# EAGLE design HPR_wo_comm (EAGLE 9.6.2)
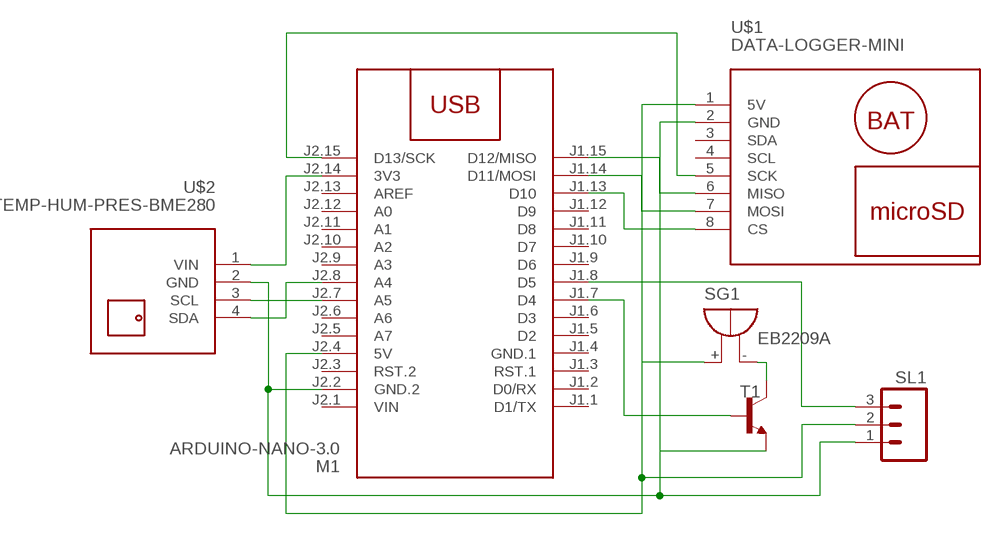
[diagram p0: schematic, sheet 1]

## Parts
M1  ARDUINO-NANO-3.0  [ARDUINO-NANO-3.0]
SG1  EB2209A  [EB2209A]
SL1  M03  [03P]
T1  2N3700-NPN-TO18-EBC  [TO18]
U$1  DATA-LOGGER-MINI  [DATA-LOGGER-MINI]
U$2  TEMP-HUM-PRES-BME280  [TEMP-HUM-PRES-BME280]

## Nets
N$1: M1.J2.14(3V3) U$2.1(VIN)
N$2: M1.J1.7(D4) T1.2(B)
N$3: M1.J2.7(A5) U$2.3(SCL)
N$4: M1.J2.8(A4) U$2.4(SDA)
N$5: M1.J1.15(D12/MISO) U$1.6(MISO)
N$6: M1.J1.14(D11/MOSI) U$1.7(MOSI)
N$7: M1.J1.13(D10) U$1.8(CS)
N$8: M1.J2.15(D13/SCK) U$1.5(SCK)
N$9: M1.J2.4(5V) SG1.+ SL1.2 U$1.1(5V)
N$10: M1.J2.2(GND.2) SL1.1 T1.1(E) U$1.2(GND) U$2.2(GND)
N$11: SG1.- T1.3(C)
N$12: M1.J1.8(D5) SL1.3
Unconnected: M1.J1.1(D1/TX) M1.J1.2(D0/RX) M1.J1.3(RST.1) M1.J1.5(D2) M1.J1.6(D3) M1.J1.9(D6) M1.J1.10(D7) M1.J1.11(D8) M1.J1.12(D9) M1.J2.3(RST.2) M1.J2.5(A7) M1.J2.6(A6) M1.J2.9(A3) M1.J2.10(A2) M1.J2.11(A1) M1.J2.12(A0) M1.J2.13(AREF) U$1.3(SDA) U$1.4(SCL)

## Power pins joined to a net without a drawn wire
GND.1: M1.J1.4(GND.1)
VIN: M1.J2.1(VIN)

## Library data of the parts
M1 = diy-modules:ARDUINO-NANO-3.0: Arduino Nano 3.0 and compatible devices More details available here: https://www.arduino.cc/en/Main/ArduinoBoardNano Click here to find device on ebay.com <http://www.ebay.com/sch/arduino+nano>
SG1 = buzzer:EB2209A: BUZZER Source: Buerklin; OC_FARNELL: unknown; OC_NEWARK: unknown
SL1 = con-amp-quick:M03: AMP QUICK CONNECTOR; OC_FARNELL: unknown; OC_NEWARK: unknown
T1 = transistor:*-NPN-: NPN Transistror BF959 corrected 2008.03.06
U$1 = HC SR04:DATA-LOGGER-MINI: Mini Data Logger with microSD card and battery powered RTC based on DS1307 chip Arduino library for DS1307 and description are available here: https://www.pjrc.com/teensy/td_libs_DS1307RTC.html Tutorial how to use SD card with Arduino: https://www.arduino.cc/en/reference/SD Click here to find device on ebay.com <http://www.ebay.com/sch/mini+data+logger+arduino>
U$2 = diy-modules:TEMP-HUM-PRES-BME280: Digital Humidity-Temperature-Pressure Sensor based on BME280 device More information about BME280 device is available here: https://www.bosch-sensortec.com/bst/products/all_products/bme280 Click here to find device on ebay.com <http://www.ebay.com/sch/bme280+breakout>

## Board
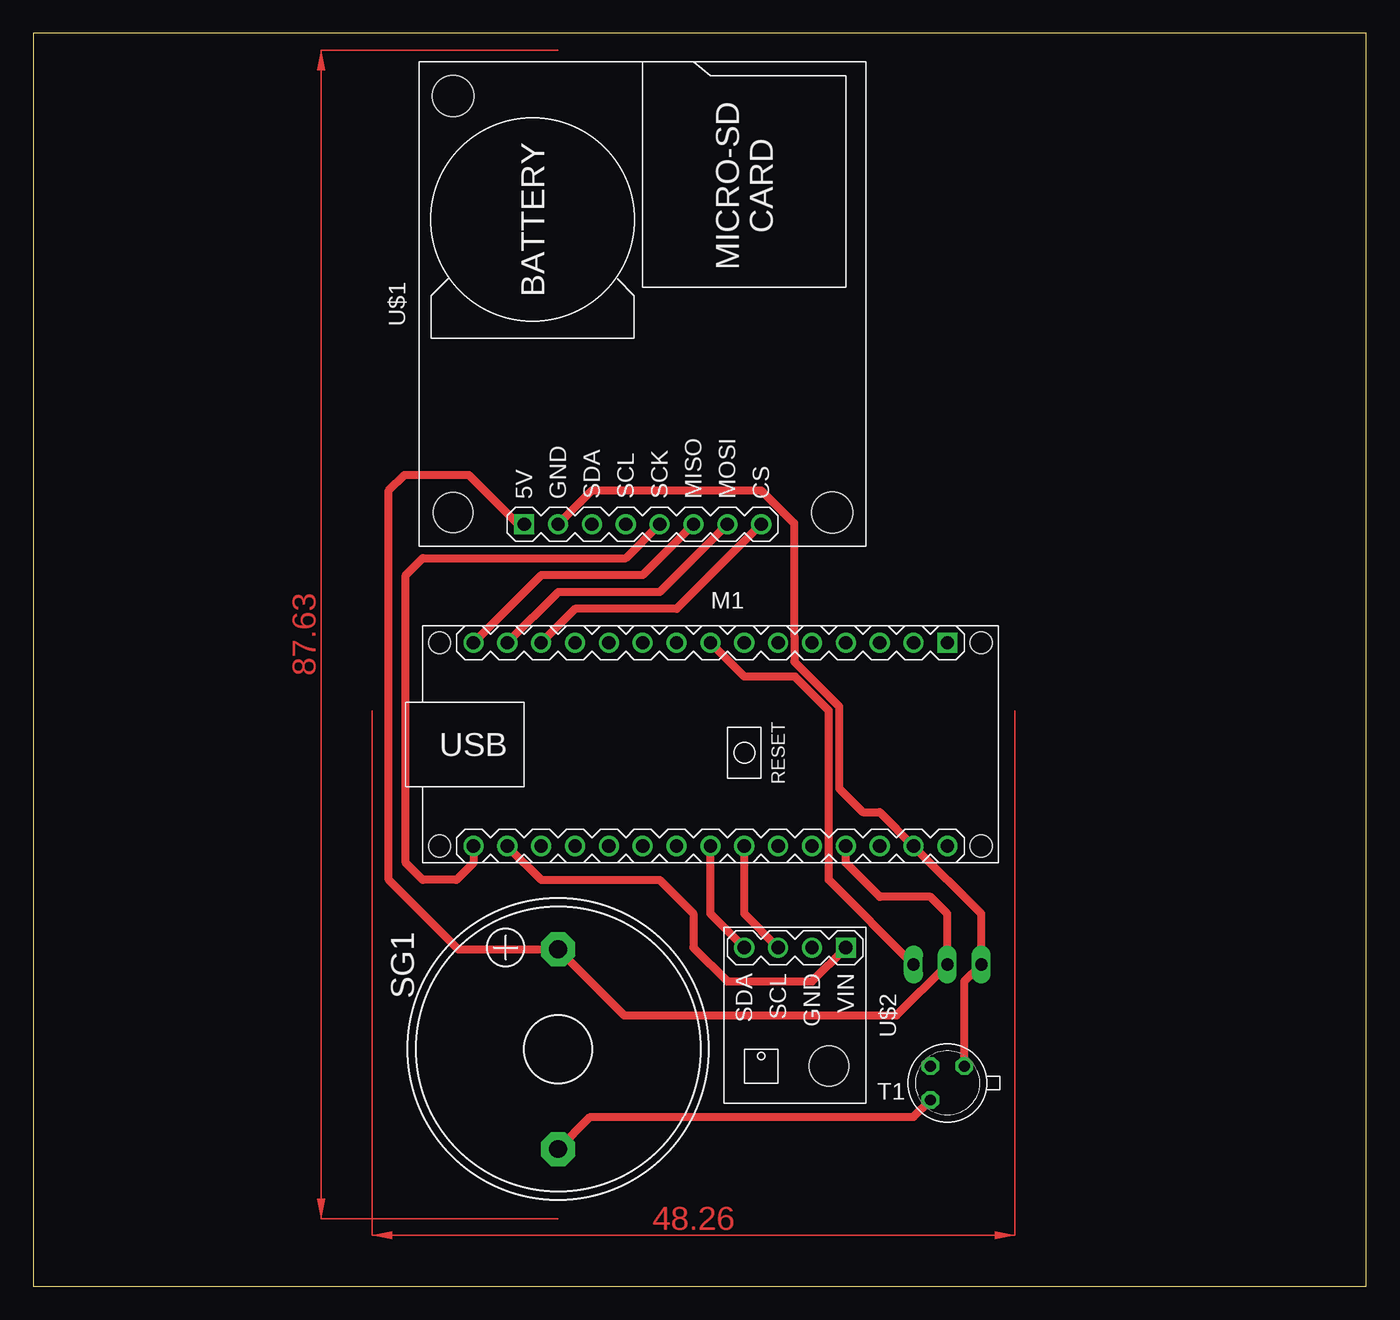
[diagram p1: board, top side]
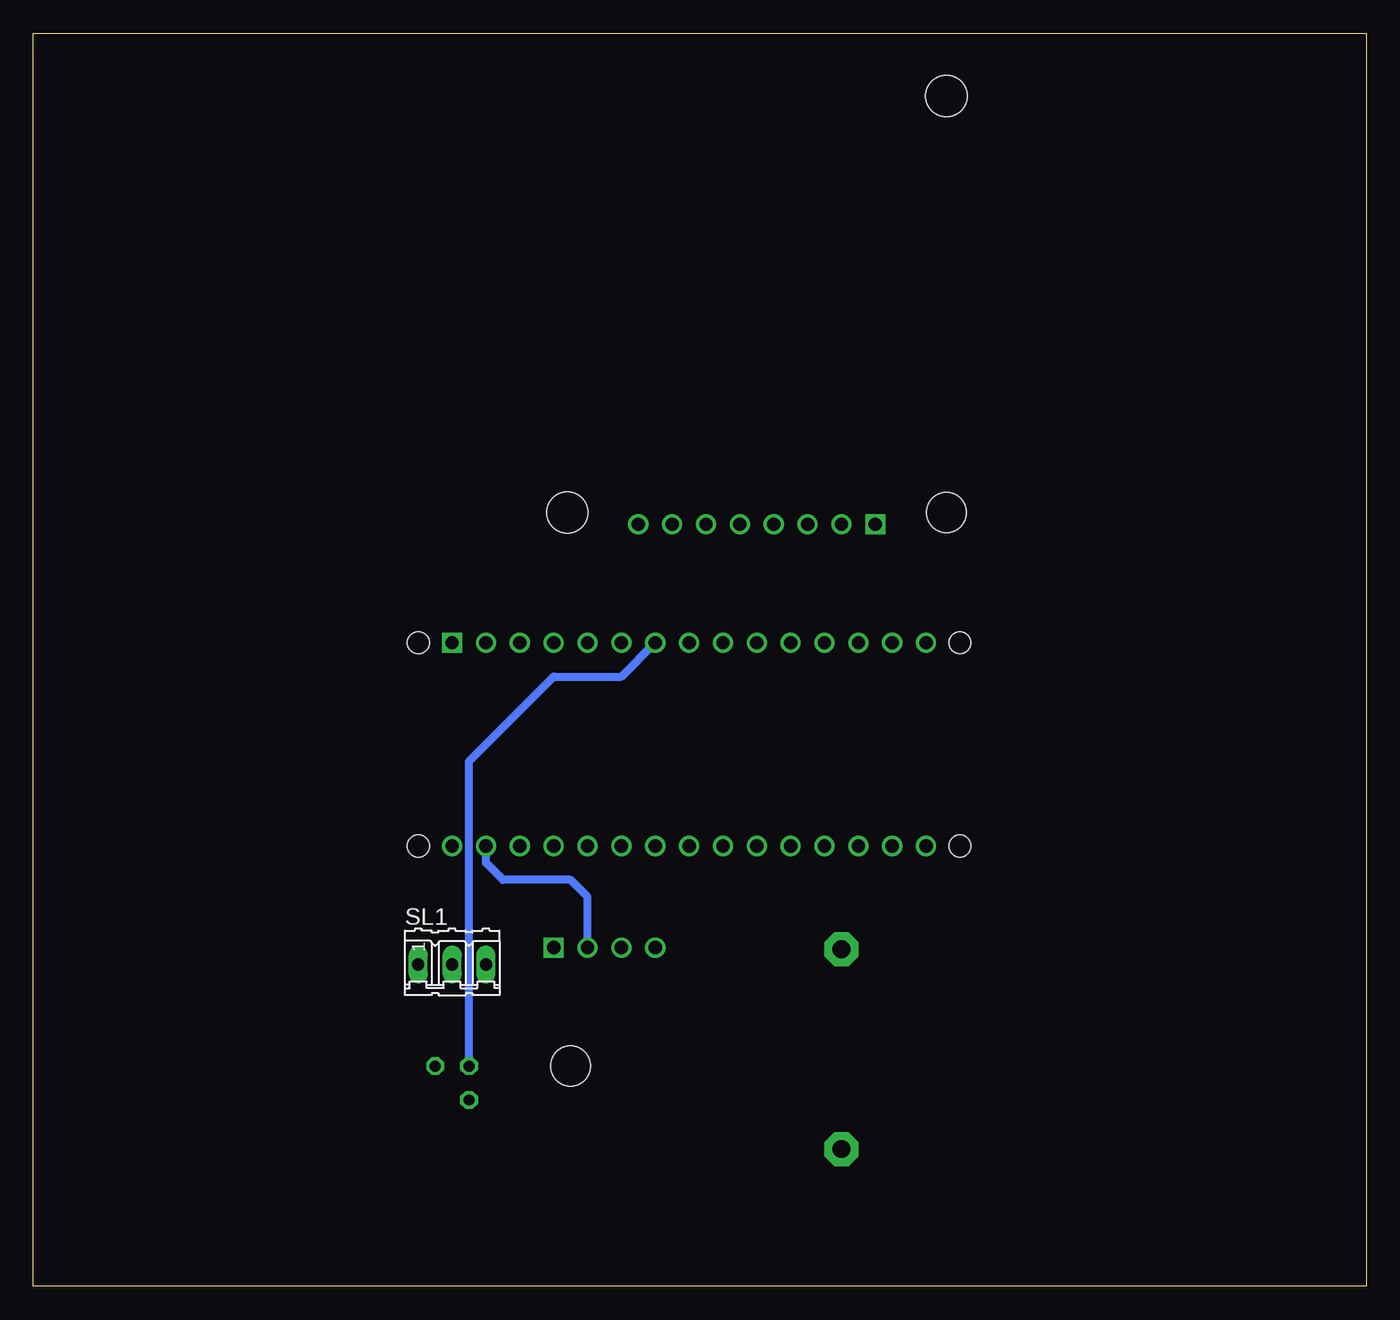
[diagram p2: board, bottom side, seen from below]

Size 100 x 93.97 mm. Coordinates in mm from the lower left corner, seen from the top.
Outline: 0,0 100,0 100,93.97 0,93.97 0,0
Copper layers (1*16): Top 0.035mm / dielectric 1.5mm / Bottom 0.035mm
Design rules "default": minimum track width 6mil, minimum drill 0.35mm, track to track 6mil, track to pad 6mil, pad to pad 6mil, via to via 6mil, smd to smd 6mil, copper to edge 40mil, drill to drill 6mil, minimum pad ring 10mil, minimum via ring 8mil, stop-mask expansion 4mil, vias tented up to drill 0mil, thermal gap 10mil

### Footprints (pad centres in the part's own frame; a part is rotated, then mirrored left to right if it is on the bottom)
ARDUINO-NANO-3.0 = drill 1 square: J1.1 17.78,7.62 | drill 1: J1.2 15.24,7.62; J1.3 12.7,7.62; J1.4 10.16,7.62; J1.5 7.62,7.62; J1.6 5.08,7.62; J1.7 2.54,7.62; J1.8 0,7.62; J1.9 -2.54,7.62; J1.10 -5.08,7.62; J1.11 -7.62,7.62; J1.12 -10.16,7.62; J1.13 -12.7,7.62; J1.14 -15.24,7.62; J1.15 -17.78,7.62; J2.1 17.78,-7.62; J2.2 15.24,-7.62; J2.3 12.7,-7.62; J2.4 10.16,-7.62; J2.5 7.62,-7.62; J2.6 5.08,-7.62; J2.7 2.54,-7.62; J2.8 0,-7.62; J2.9 -2.54,-7.62; J2.10 -5.08,-7.62; J2.11 -7.62,-7.62; J2.12 -10.16,-7.62; J2.13 -12.7,-7.62; J2.14 -15.24,-7.62; J2.15 -17.78,-7.62 | hole 1.651: -20.32,7.62; -20.32,-7.62; 20.32,-7.62; 20.32,7.62
EB2209A = drill 1.321 pad 2.54 octagon: + 7.493,0; - -7.493,0
03P = drill 0.914 long: 1 -2.54,0; 2 0,0; 3 2.54,0
TO18 = drill 0.813 octagon: 1 -1.27,-1.27; 2 1.27,-1.27; 3 1.27,1.27
DATA-LOGGER-MINI = drill 1 square: 1 -16.51,8.89 | drill 1: 2 -16.51,6.35; 3 -16.51,3.81; 4 -16.51,1.27; 5 -16.51,-1.27; 6 -16.51,-3.81; 7 -16.51,-6.35; 8 -16.51,-8.89 | hole 3: -15.621,14.224 | hole 3.1: -15.621,-14.224; 15.621,14.224
TEMP-HUM-PRES-BME280 = drill 1 square: 1 -5.08,3.81 | drill 1: 2 -5.08,1.27; 3 -5.08,-1.27; 4 -5.08,-3.81 | hole 3: 3.81,2.54

### Placement (x,y rotation side)
M1  50.8,40.64 0 top
SG1  39.37,17.78 90 top
SL1  68.58,24.13 0 bottom
T1  68.58,15.24 180 top
U$1  45.72,73.66 90 top
U$2  57.15,20.32 270 top

### Tracks (layer width: path | path; a pad name or v marks a point on that pad's centre or on a via)
N$1
  Top 0.61: M1.J2.14 38.1,30.48 46.99,30.48 49.53,27.94 49.53,25.4 52.07,22.86 58.42,22.86 U$2.1
N$2
  Bottom 0.61: T1.2 67.31,39.37 60.96,45.72 55.88,45.72 M1.J1.7
N$3
  Top 0.61: U$2.3 53.34,27.94 M1.J2.7
N$4
  Top 0.61: U$2.4 50.8,27.94 M1.J2.8
N$5
  Top 0.61: U$1.6 45.72,53.34 38.1,53.34 M1.J1.15
N$6
  Top 0.61: U$1.7 46.99,52.07 39.37,52.07 M1.J1.14
N$7
  Top 0.61: U$1.8 48.26,50.8 40.64,50.8 M1.J1.13
N$8
  Top 0.61: M1.J2.15 33.02,31.75 31.75,30.48 29.21,30.48 27.94,31.75 27.94,53.34 29.21,54.61 44.45,54.61 U$1.5
N$9
  Top 0.61: M1.J2.4 60.96,31.75 63.5,29.21 67.31,29.21 68.58,27.94 SL1.2 64.77,20.32 44.32,20.32 SG1.+ 31.88,25.27 26.67,30.48 26.67,59.69 27.84,60.86 32.66,60.86 36.37,57.15 U$1.1
N$10
  Top 0.61: T1.1 69.85,22.86 SL1.1 71.12,27.94 M1.J2.2 63.5,35.56 62.23,35.56 60.45,37.34 60.45,43.5 57.09,46.86 57.09,48.76 57.07,48.78 57.07,57.23 54.61,59.69 41.91,59.69 U$1.2
  Bottom 0.61: U$2.2 58.42,29.21 59.69,30.48 64.77,30.48 66.04,31.75 M1.J2.2
N$11
  Top 0.61: SG1.- 41.78,12.7 66.04,12.7 T1.3
N$12
  Top 0.61: SL1.3 59.69,30.48 59.69,43.18 57.15,45.72 53.34,45.72 M1.J1.8
(copper drawn outside any net)
  shapes: Top area x2